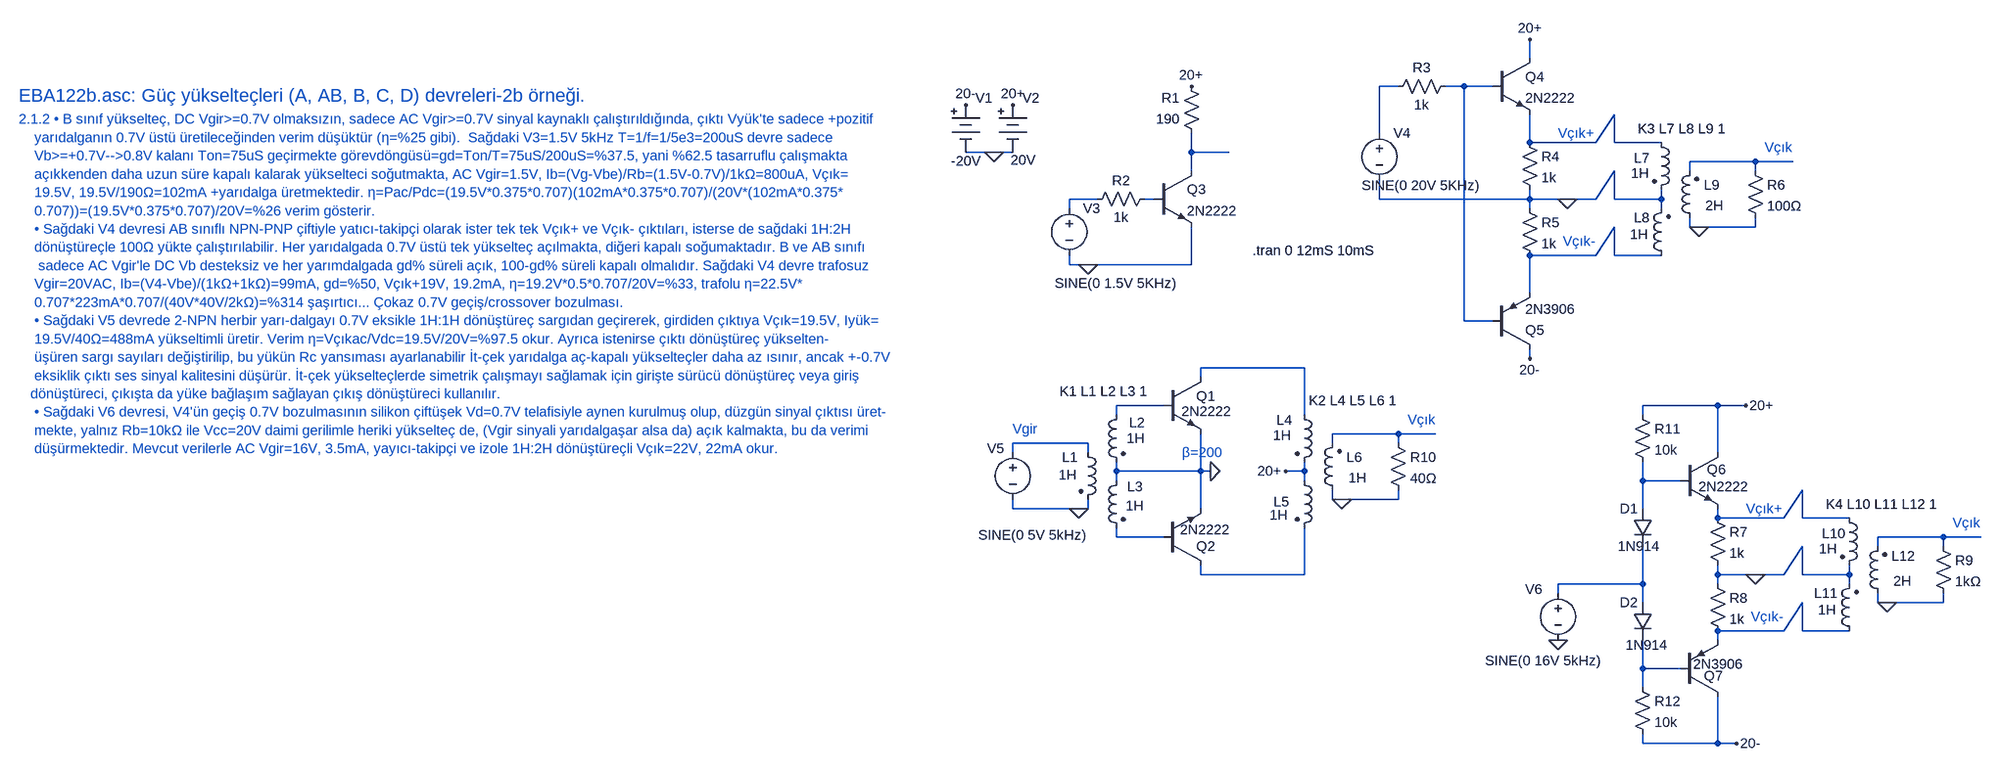
[diagram p0: schematic EBA122b.asc]
EBA122b.asc, the LTspice schematic file:
Version 4
SHEET 1 5332 4332
WIRE 2528 -16 2528 -48
WIRE 2304 32 2272 32
WIRE 2416 32 2384 32
WIRE 2464 32 2416 32
WIRE 2272 112 2272 32
WIRE 2528 128 2528 80
WIRE 2640 128 2672 80
WIRE 2640 128 2528 128
WIRE 2672 128 2672 80
WIRE 2752 128 2672 128
WIRE 1616 144 1568 144
WIRE 1648 144 1616 144
WIRE 1952 144 1952 112
WIRE 2016 144 1952 144
WIRE 2912 160 2800 160
WIRE 2976 160 2912 160
WIRE 1952 176 1952 144
WIRE 2800 176 2800 160
WIRE 2912 176 2912 160
WIRE 1792 224 1744 224
WIRE 1888 224 1872 224
WIRE 2272 224 2272 192
WIRE 2528 224 2528 208
WIRE 2528 224 2272 224
WIRE 2592 224 2528 224
WIRE 2640 224 2672 176
WIRE 2640 224 2592 224
WIRE 2672 224 2672 176
WIRE 2752 224 2752 208
WIRE 2752 224 2672 224
WIRE 1744 240 1744 224
WIRE 2528 240 2528 224
WIRE 2752 240 2752 224
WIRE 2800 272 2800 256
WIRE 2816 272 2800 272
WIRE 2912 272 2912 256
WIRE 2912 272 2816 272
WIRE 2640 320 2672 272
WIRE 2640 320 2528 320
WIRE 2672 320 2672 272
WIRE 2752 320 2672 320
WIRE 1744 336 1744 320
WIRE 1776 336 1744 336
WIRE 1952 336 1952 272
WIRE 1952 336 1776 336
WIRE 2528 384 2528 320
WIRE 2416 432 2416 32
WIRE 2464 432 2416 432
WIRE 2528 496 2528 480
WIRE 2144 512 1968 512
WIRE 1968 528 1968 512
WIRE 1904 576 1824 576
WIRE 2848 576 2720 576
WIRE 2896 576 2848 576
WIRE 1824 592 1824 576
WIRE 2144 592 2144 512
WIRE 2720 592 2720 576
WIRE 2304 624 2192 624
WIRE 2368 624 2304 624
WIRE 1776 640 1648 640
WIRE 2192 640 2192 624
WIRE 2304 640 2304 624
WIRE 1648 656 1648 640
WIRE 1776 656 1776 640
WIRE 2848 656 2848 576
WIRE 1824 688 1824 672
WIRE 1968 688 1968 624
WIRE 1968 688 1824 688
WIRE 1984 688 1968 688
WIRE 2144 688 2144 672
WIRE 2144 688 2112 688
WIRE 1824 704 1824 688
WIRE 2144 704 2144 688
WIRE 2720 704 2720 672
WIRE 2784 704 2720 704
WIRE 2192 736 2192 720
WIRE 2208 736 2192 736
WIRE 2304 736 2304 720
WIRE 2304 736 2208 736
WIRE 1648 752 1648 736
WIRE 1760 752 1648 752
WIRE 1776 752 1776 736
WIRE 1776 752 1760 752
WIRE 1968 752 1968 688
WIRE 2720 752 2720 704
WIRE 2848 768 2848 752
WIRE 2960 768 2992 720
WIRE 2960 768 2848 768
WIRE 2992 768 2992 720
WIRE 3072 768 2992 768
WIRE 1824 800 1824 784
WIRE 1904 800 1824 800
WIRE 3232 800 3120 800
WIRE 3296 800 3232 800
WIRE 3120 816 3120 800
WIRE 3232 816 3232 800
WIRE 1968 864 1968 848
WIRE 2144 864 2144 784
WIRE 2144 864 1968 864
WIRE 2848 864 2848 848
WIRE 2912 864 2848 864
WIRE 2960 864 2992 816
WIRE 2960 864 2912 864
WIRE 2992 864 2992 816
WIRE 3072 864 3072 848
WIRE 3072 864 2992 864
WIRE 2720 880 2720 816
WIRE 2720 880 2576 880
WIRE 2848 880 2848 864
WIRE 3072 880 3072 864
WIRE 2576 896 2576 880
WIRE 2720 912 2720 880
WIRE 3120 912 3120 896
WIRE 3136 912 3120 912
WIRE 3232 912 3232 896
WIRE 3232 912 3136 912
WIRE 2960 960 2992 912
WIRE 2960 960 2848 960
WIRE 2992 960 2992 912
WIRE 3072 960 2992 960
WIRE 2848 976 2848 960
WIRE 2720 1024 2720 976
WIRE 2784 1024 2720 1024
WIRE 2720 1056 2720 1024
WIRE 2720 1152 2720 1136
WIRE 2848 1152 2848 1072
WIRE 2848 1152 2720 1152
WIRE 2880 1152 2848 1152
FLAG 1760 752 0
FLAG 1984 688 0
FLAG 2208 736 0
FLAG 2112 688 20+
FLAG 1616 144 0
FLAG 1648 64 20+
FLAG 2592 224 0
FLAG 1776 336 0
FLAG 1952 32 20+
FLAG 2528 -48 20+
FLAG 1568 64 20-
FLAG 2528 496 20-
FLAG 2816 272 0
FLAG 2896 576 20+
FLAG 2912 864 0
FLAG 3136 912 0
FLAG 2880 1152 20-
FLAG 2576 976 0
SYMBOL ind2 1760 640 R0
WINDOW 0 -28 24 Left 2
WINDOW 3 -34 54 Left 2
SYMATTR InstName L1
SYMATTR Value 1H
SYMATTR Type ind
SYMATTR SpiceLine Rser=600Ω
SYMBOL ind2 1840 576 M0
WINDOW 0 -33 29 Left 2
WINDOW 3 -33 56 Left 2
SYMATTR InstName L2
SYMATTR Value 1H
SYMATTR Type ind
SYMBOL ind2 1840 688 M0
WINDOW 0 -30 26 Left 2
WINDOW 3 -31 59 Left 2
SYMATTR InstName L3
SYMATTR Value 1H
SYMATTR Type ind
SYMBOL voltage 1648 640 R0
WINDOW 0 -44 9 Left 2
WINDOW 3 -59 157 Left 2
WINDOW 123 0 0 Left 0
WINDOW 39 0 0 Left 0
SYMATTR InstName V5
SYMATTR Value SINE(0 5V 5kHz)
SYMBOL npn 1904 528 R0
WINDOW 3 31 58 Left 2
SYMATTR Value 2N2222
SYMATTR InstName Q1
SYMBOL npn 1904 848 M180
WINDOW 3 29 60 Left 2
SYMATTR Value 2N2222
SYMATTR InstName Q2
SYMBOL ind2 2128 576 R0
WINDOW 0 -31 25 Left 2
WINDOW 3 -37 51 Left 2
SYMATTR InstName L4
SYMATTR Value 1H
SYMATTR Type ind
SYMBOL ind2 2128 688 R0
WINDOW 0 -36 52 Left 2
WINDOW 3 -43 75 Left 2
SYMATTR InstName L5
SYMATTR Value 1H
SYMATTR Type ind
SYMBOL ind2 2208 736 R180
WINDOW 0 -35 72 Left 2
WINDOW 3 -42 37 Left 2
SYMATTR InstName L6
SYMATTR Value 1H
SYMATTR Type ind
SYMBOL res 2288 624 R0
SYMATTR InstName R10
SYMATTR Value 40Ω
SYMBOL Misc\\battery 1648 48 R0
WINDOW 0 16 4 Left 2
WINDOW 3 -4 110 Left 2
SYMATTR InstName V2
SYMATTR Value 20V
SYMBOL npn 2464 -16 R0
SYMATTR InstName Q4
SYMATTR Value 2N2222
SYMBOL voltage 2272 96 R0
WINDOW 3 -30 105 Left 2
WINDOW 123 0 0 Left 0
WINDOW 39 0 0 Left 0
SYMATTR Value SINE(0 20V 5KHz)
SYMATTR InstName V4
SYMBOL res 2400 16 R90
WINDOW 0 0 56 VBottom 2
WINDOW 3 32 56 VTop 2
SYMATTR InstName R3
SYMATTR Value 1k
SYMBOL res 2512 112 R0
SYMATTR InstName R4
SYMATTR Value 1k
SYMBOL res 2512 224 R0
SYMATTR InstName R5
SYMATTR Value 1k
SYMBOL pnp 2464 480 M180
SYMATTR InstName Q5
SYMATTR Value 2N3906
SYMBOL npn 1888 176 R0
SYMATTR InstName Q3
SYMATTR Value 2N2222
SYMBOL res 1968 128 R180
WINDOW 0 36 76 Left 2
WINDOW 3 36 40 Left 2
SYMATTR InstName R1
SYMATTR Value 190
SYMBOL voltage 1744 224 R0
WINDOW 3 -25 144 Left 2
WINDOW 123 0 0 Left 0
WINDOW 39 0 0 Left 0
SYMATTR Value SINE(0 1.5V 5KHz)
SYMATTR InstName V3
SYMBOL res 1888 208 R90
WINDOW 0 0 56 VBottom 2
WINDOW 3 32 56 VTop 2
SYMATTR InstName R2
SYMATTR Value 1k
SYMBOL Misc\\battery 1568 48 R0
WINDOW 0 16 4 Left 2
WINDOW 3 -25 111 Left 2
SYMATTR InstName V1
SYMATTR Value -20V
SYMBOL ind2 2736 112 R0
WINDOW 0 -31 42 Left 2
WINDOW 3 -36 68 Left 2
SYMATTR InstName L7
SYMATTR Value 1H
SYMATTR Type ind
SYMBOL ind2 2768 336 R180
WINDOW 0 36 80 Left 2
WINDOW 3 39 52 Left 2
SYMATTR InstName L8
SYMATTR Value 1H
SYMATTR Type ind
SYMBOL ind2 2816 272 R180
WINDOW 0 -35 72 Left 2
WINDOW 3 -42 37 Left 2
SYMATTR InstName L9
SYMATTR Value 2H
SYMATTR Type ind
SYMBOL res 2896 160 R0
SYMATTR InstName R6
SYMATTR Value 100Ω
SYMBOL npn 2784 656 R0
WINDOW 0 45 29 Left 2
WINDOW 3 31 58 Left 2
SYMATTR InstName Q6
SYMATTR Value 2N2222
SYMBOL pnp 2784 1072 M180
WINDOW 0 40 35 Left 2
WINDOW 3 22 55 Left 2
SYMATTR InstName Q7
SYMATTR Value 2N3906
SYMBOL voltage 2576 880 R0
WINDOW 3 -124 131 Left 2
WINDOW 123 0 0 Left 0
WINDOW 39 0 0 Left 0
WINDOW 0 -56 9 Left 2
SYMATTR Value SINE(0 16V 5kHz)
SYMATTR InstName V6
SYMBOL diode 2736 752 M0
WINDOW 3 -13 64 Left 2
SYMATTR Value 1N914
SYMATTR InstName D1
SYMBOL diode 2736 912 M0
WINDOW 3 -26 72 Left 2
SYMATTR Value 1N914
SYMATTR InstName D2
SYMBOL res 2832 752 R0
SYMATTR InstName R7
SYMATTR Value 1k
SYMBOL res 2832 864 R0
SYMATTR InstName R8
SYMATTR Value 1k
SYMBOL ind2 3056 752 R0
WINDOW 0 -31 42 Left 2
WINDOW 3 -36 68 Left 2
SYMATTR InstName L10
SYMATTR Value 1H
SYMATTR Type ind
SYMBOL ind2 3088 976 R180
WINDOW 0 36 80 Left 2
WINDOW 3 39 52 Left 2
SYMATTR InstName L11
SYMATTR Value 1H
SYMATTR Type ind
SYMBOL ind2 3136 912 R180
WINDOW 0 -48 79 Left 2
WINDOW 3 -42 37 Left 2
SYMATTR InstName L12
SYMATTR Value 2H
SYMATTR Type ind
SYMBOL res 3216 800 R0
SYMATTR InstName R9
SYMATTR Value 1kΩ
SYMBOL res 2704 576 R0
SYMATTR InstName R11
SYMATTR Value 10k
SYMBOL res 2704 1040 R0
SYMATTR InstName R12
SYMATTR Value 10k
TEXT -224 48 Left 3 ;EBA122b.asc: Güç yükselteçleri (A, AB, B, C, D) devreleri-2b örneği.
TEXT -224 88 Left 2 ;2.1.2 • B sınıf yükselteç, DC Vgir>=0.7V olmaksızın, sadece AC Vgir>=0.7V sinyal kaynaklı çalıştırıldığında, çıktı Vyük'te sadece +pozitif\n    yarıdalganın 0.7V üstü üretileceğinden verim düşüktür (η=%25 gibi).  Sağdaki V3=1.5V 5kHz T=1/f=1/5e3=200uS devre sadece\n    Vb>=+0.7V-->0.8V kalanı Ton=75uS geçirmekte görevdöngüsü=gd=Ton/T=75uS/200uS=%37.5, yani %62.5 tasarruflu çalışmakta\n    açıkkenden daha uzun süre kapalı kalarak yükselteci soğutmakta, AC Vgir=1.5V, Ib=(Vg-Vbe)/Rb=(1.5V-0.7V)/1kΩ=800uA, Vçık=\n    19.5V, 19.5V/190Ω=102mA +yarıdalga üretmektedir. η=Pac/Pdc=(19.5V*0.375*0.707)(102mA*0.375*0.707)/(20V*(102mA*0.375*\n    0.707))=(19.5V*0.375*0.707)/20V=%26 verim gösterir.\n    • Sağdaki V4 devresi AB sınıflı NPN-PNP çiftiyle yatıcı-takipçi olarak ister tek tek Vçık+ ve Vçık- çıktıları, isterse de sağdaki 1H:2H\n    dönüştüreçle 100Ω yükte çalıştırılabilir. Her yarıdalgada 0.7V üstü tek yükselteç açılmakta, diğeri kapalı soğumaktadır. B ve AB sınıfı\n     sadece AC Vgir'le DC Vb desteksiz ve her yarımdalgada gd% süreli açık, 100-gd% süreli kapalı olmalıdır. Sağdaki V4 devre trafosuz \n    Vgir=20VAC, Ib=(V4-Vbe)/(1kΩ+1kΩ)=99mA, gd=%50, Vçık+19V, 19.2mA, η=19.2V*0.5*0.707/20V=%33, trafolu η=22.5V*\n    0.707*223mA*0.707/(40V*40V/2kΩ)=%314 şaşırtıcı... Çokaz 0.7V geçiş/crossover bozulması.\n    • Sağdaki V5 devrede 2-NPN herbir yarı-dalgayı 0.7V eksikle 1H:1H dönüştüreç sargıdan geçirerek, girdiden çıktıya Vçık=19.5V, Iyük=\n    19.5V/40Ω=488mA yükseltimli üretir. Verim η=Vçıkac/Vdc=19.5V/20V=%97.5 okur. Ayrıca istenirse çıktı dönüştüreç yükselten-\n    üşüren sargı sayıları değiştirilip, bu yükün Rc yansıması ayarlanabilir İt-çek yarıdalga aç-kapalı yükselteçler daha az ısınır, ancak +-0.7V\n    eksiklik çıktı ses sinyal kalitesini düşürür. İt-çek yükselteçlerde simetrik çalışmayı sağlamak için girişte sürücü dönüştüreç veya giriş \n   dönüştüreci, çıkışta da yüke bağlaşım sağlayan çıkış dönüştüreci kullanılır.\n    • Sağdaki V6 devresi, V4'ün geçiş 0.7V bozulmasının silikon çiftüşek Vd=0.7V telafisiyle aynen kurulmuş olup, düzgün sinyal çıktısı üret-\n    mekte, yalnız Rb=10kΩ ile Vcc=20V daimi gerilimle heriki yükselteç de, (Vgir sinyali yarıdalgaşar alsa da) açık kalmakta, bu da verimi \n    düşürmektedir. Mevcut verilerle AC Vgir=16V, 3.5mA, yayıcı-takipçi ve izole 1H:2H dönüştüreçli Vçık=22V, 22mA okur.
TEXT 2320 600 Left 2 ;Vçık
TEXT 1648 616 Left 2 ;Vgir
TEXT 1728 552 Left 2 !K1 L1 L2 L3 1
TEXT 2152 568 Left 2 !K2 L4 L5 L6 1
TEXT 2056 312 Left 2 !.tran 0 12mS 10mS
TEXT 1936 656 Left 2 ;β=200
TEXT 2928 136 Left 2 ;Vçık
TEXT 2712 104 Left 2 !K3 L7 L8 L9 1
TEXT 2576 112 Left 2 ;Vçık+
TEXT 2584 296 Left 2 ;Vçık-
TEXT 3248 776 Left 2 ;Vçık
TEXT 3032 744 Left 2 !K4 L10 L11 L12 1
TEXT 2896 752 Left 2 ;Vçık+
TEXT 2904 936 Left 2 ;Vçık-

The netlist it stands for:
* EBA122b.asc
L1 N012 0 1H Rser=600Ω
L2 N010 0 1H
L3 0 N015 1H
V5 N012 0 SINE(0 5V 5kHz)
Q1 N009 N010 0 0 2N2222
Q2 N017 N015 0 0 2N2222
L4 N009 20+ 1H
L5 20+ N017 1H
L6 0 N011 1H
R10 N011 0 40Ω
V2 20+ 0 20V
Q4 20+ N002 N003 0 2N2222
V4 N001 0 SINE(0 20V 5KHz)
R3 N002 N001 1k
R4 N003 0 1k
R5 0 N008 1k
Q5 20- N002 N008 0 2N3906
Q3 N004 N007 0 0 2N2222
R1 N004 20+ 190
V3 N006 0 SINE(0 1.5V 5KHz)
R2 N007 N006 1k
V1 20- 0 -20V
L7 N003 0 1H
L8 N008 0 1H
L9 0 N005 2H
R6 N005 0 100Ω
Q6 20+ N013 N014 0 2N2222
Q7 20- N020 N019 0 2N3906
V6 N018 0 SINE(0 16V 5kHz)
D1 N013 N018 1N914
D2 N018 N020 1N914
R7 N014 0 1k
R8 0 N019 1k
L10 N014 0 1H
L11 N019 0 1H
L12 0 N016 2H
R9 N016 0 1kΩ
R11 20+ N013 10k
R12 N020 20- 10k
.model D D
.lib standard.dio
.model NPN NPN
.model PNP PNP
.lib standard.bjt
* EBA122b.asc: Güç yükselteçleri (A, AB, B, C, D) devreleri-2b örneği.
* 2.1.2 • B sınıf yükselteç, DC Vgir>=0.7V olmaksızın, sadece AC Vgir>=0.7V sinyal kaynaklı çalıştırıldığında, çıktı Vyük'te sadece +pozitif
*     yarıdalganın 0.7V üstü üretileceğinden verim düşüktür (η=%25 gibi).  Sağdaki V3=1.5V 5kHz T=1/f=1/5e3=200uS devre sadece
*     Vb>=+0.7V-->0.8V kalanı Ton=75uS geçirmekte görevdöngüsü=gd=Ton/T=75uS/200uS=%37.5, yani %62.5 tasarruflu çalışmakta
*     açıkkenden daha uzun süre kapalı kalarak yükselteci soğutmakta, AC Vgir=1.5V, Ib=(Vg-Vbe)/Rb=(1.5V-0.7V)/1kΩ=800uA, Vçık=
*     19.5V, 19.5V/190Ω=102mA +yarıdalga üretmektedir. η=Pac/Pdc=(19.5V*0.375*0.707)(102mA*0.375*0.707)/(20V*(102mA*0.375*
*     0.707))=(19.5V*0.375*0.707)/20V=%26 verim gösterir.
*     • Sağdaki V4 devresi AB sınıflı NPN-PNP çiftiyle yatıcı-takipçi olarak ister tek tek Vçık+ ve Vçık- çıktıları, isterse de sağdaki 1H:2H
*     dönüştüreçle 100Ω yükte çalıştırılabilir. Her yarıdalgada 0.7V üstü tek yükselteç açılmakta, diğeri kapalı soğumaktadır. B ve AB sınıfı
*      sadece AC Vgir'le DC Vb desteksiz ve her yarımdalgada gd% süreli açık, 100-gd% süreli kapalı olmalıdır. Sağdaki V4 devre trafosuz
*     Vgir=20VAC, Ib=(V4-Vbe)/(1kΩ+1kΩ)=99mA, gd=%50, Vçık+19V, 19.2mA, η=19.2V*0.5*0.707/20V=%33, trafolu η=22.5V*
*     0.707*223mA*0.707/(40V*40V/2kΩ)=%314 şaşırtıcı... Çokaz 0.7V geçiş/crossover bozulması.
*     • Sağdaki V5 devrede 2-NPN herbir yarı-dalgayı 0.7V eksikle 1H:1H dönüştüreç sargıdan geçirerek, girdiden çıktıya Vçık=19.5V, Iyük=
*     19.5V/40Ω=488mA yükseltimli üretir. Verim η=Vçıkac/Vdc=19.5V/20V=%97.5 okur. Ayrıca istenirse çıktı dönüştüreç yükselten-
*     üşüren sargı sayıları değiştirilip, bu yükün Rc yansıması ayarlanabilir İt-çek yarıdalga aç-kapalı yükselteçler daha az ısınır, ancak +-0.7V
*     eksiklik çıktı ses sinyal kalitesini düşürür. İt-çek yükselteçlerde simetrik çalışmayı sağlamak için girişte sürücü dönüştüreç veya giriş
*    dönüştüreci, çıkışta da yüke bağlaşım sağlayan çıkış dönüştüreci kullanılır.
*     • Sağdaki V6 devresi, V4'ün geçiş 0.7V bozulmasının silikon çiftüşek Vd=0.7V telafisiyle aynen kurulmuş olup, düzgün sinyal çıktısı üret-
*     mekte, yalnız Rb=10kΩ ile Vcc=20V daimi gerilimle heriki yükselteç de, (Vgir sinyali yarıdalgaşar alsa da) açık kalmakta, bu da verimi
*     düşürmektedir. Mevcut verilerle AC Vgir=16V, 3.5mA, yayıcı-takipçi ve izole 1H:2H dönüştüreçli Vçık=22V, 22mA okur.
* Vçık
* Vgir
K1 L1 L2 L3 1
K2 L4 L5 L6 1
.tran 0 12mS 10mS
* β=200
* Vçık
K3 L7 L8 L9 1
* Vçık+
* Vçık-
* Vçık
K4 L10 L11 L12 1
* Vçık+
* Vçık-
.backanno
.end